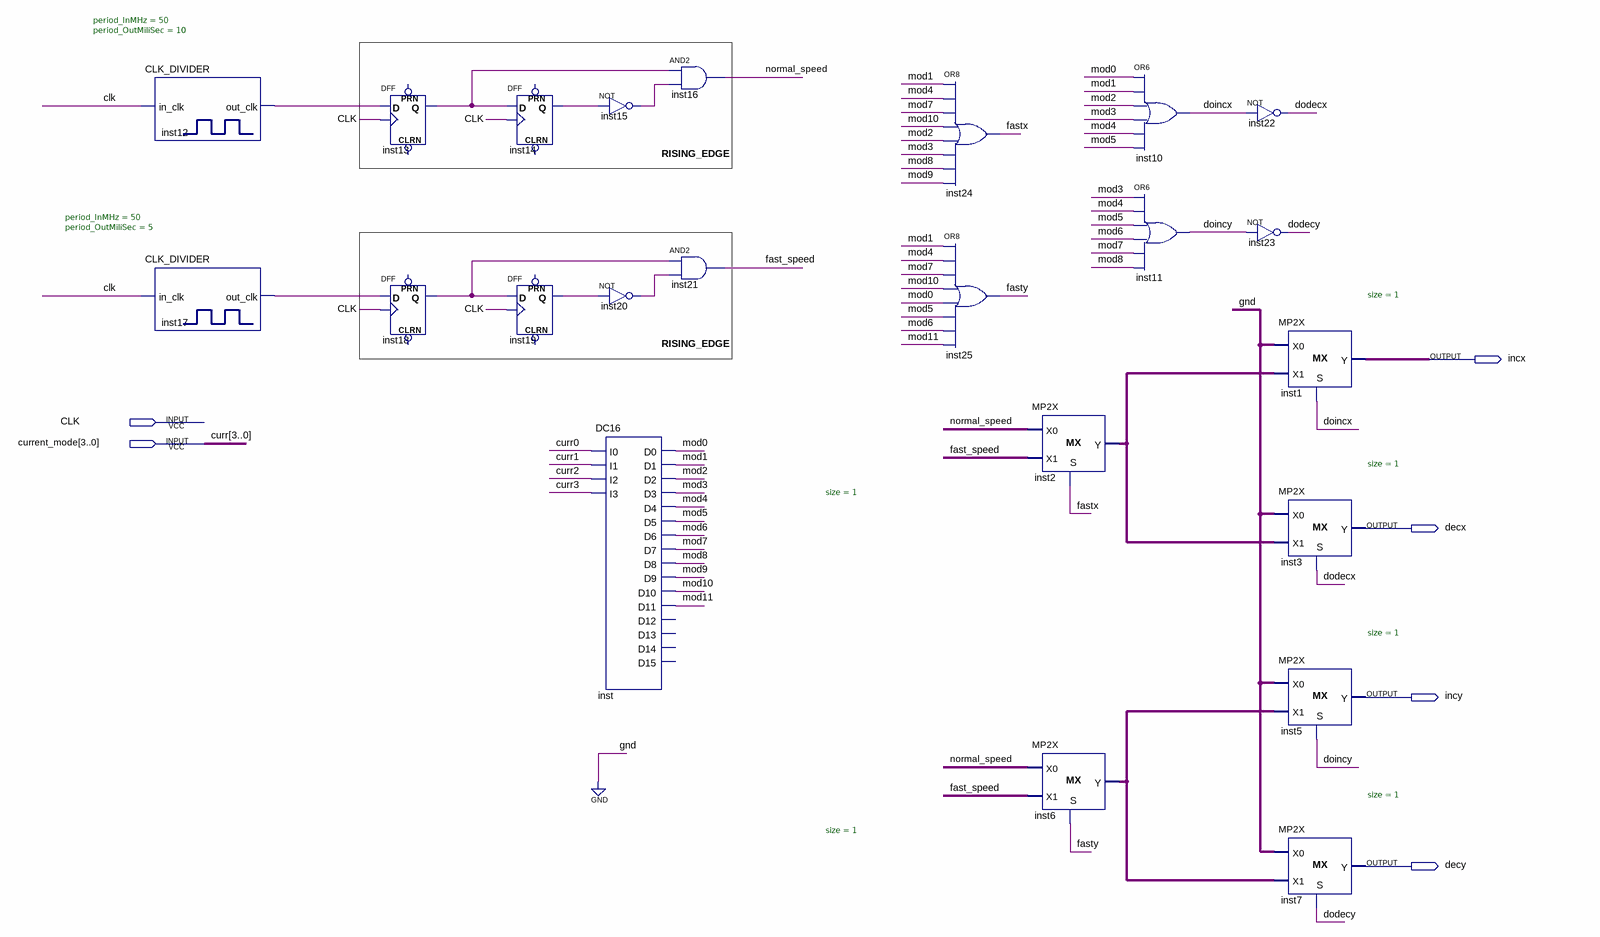
[diagram p0: schematic sheet]
// Quartus schematic ball_movement.bdf as structural Verilog: 23 symbols, 6 pins
module ball_movement (
  input  CLK,
  input  [3:0] current_mode,
  output incx,
  output decx,
  output incy,
  output decy
);

  wire dodecx, dodecy, doincx, doincy, fast_speed, fastx, fasty, inst2_y, inst6_y, inst12_out_clk, inst13_q,
       inst14_q, inst15_out, inst17_out_clk, inst18_q, inst19_q, inst20_out, mod0, mod1, mod2, mod3, mod4,
       mod5, mod6, mod7, mod8, mod9, mod10, mod11, normal_speed;

  CLK_DIVIDER #(.period_InMHz(50), .period_OutMiliSec(10)) inst12 (.in_clk(CLK), .out_clk(inst12_out_clk));
  CLK_DIVIDER #(.period_InMHz(50), .period_OutMiliSec(5)) inst17 (.in_clk(CLK), .out_clk(inst17_out_clk));
  DFF inst13 (.CLK(CLK), .D(inst12_out_clk), .Q(inst13_q));  // open: CLRN, PRN
  DFF inst18 (.CLK(CLK), .D(inst17_out_clk), .Q(inst18_q));  // open: CLRN, PRN
  DFF inst14 (.CLK(CLK), .D(inst13_q), .Q(inst14_q));  // open: CLRN, PRN
  DFF inst19 (.CLK(CLK), .D(inst18_q), .Q(inst19_q));  // open: CLRN, PRN
  not inst15 (inst15_out, inst14_q);
  not inst20 (inst20_out, inst19_q);
  DC16 inst (
    .I0(current_mode[0]), .I1(current_mode[1]), .I2(current_mode[2]), .I3(current_mode[3]), .D0(mod0),
    .D1(mod1), .D2(mod2), .D3(mod3), .D4(mod4), .D5(mod5), .D6(mod6), .D7(mod7), .D8(mod8), .D9(mod9),
    .D10(mod10), .D11(mod11));  // open: D12, D13, D14, D15
  and inst16 (normal_speed, inst13_q, inst15_out);
  and inst21 (fast_speed, inst18_q, inst20_out);
  or inst24 (fastx, mod1, mod4, mod7, mod10, mod2, mod3, mod8, mod9);
  or inst25 (fasty, mod1, mod4, mod7, mod10, mod0, mod5, mod6, mod11);
  MP2X #(.size(1)) inst2 (.S(fastx), .X0(normal_speed), .X1(fast_speed), .Y(inst2_y));
  MP2X #(.size(1)) inst6 (.S(fasty), .X0(normal_speed), .X1(fast_speed), .Y(inst6_y));
  or inst10 (doincx, mod0, mod1, mod2, mod3, mod4, mod5);
  or inst11 (doincy, mod3, mod4, mod5, mod6, mod7, mod8);
  not inst22 (dodecx, doincx);
  not inst23 (dodecy, doincy);
  MP2X #(.size(1)) inst1 (.S(doincx), .X0(1'b0), .X1(inst2_y), .Y(incx));
  MP2X #(.size(1)) inst3 (.S(dodecx), .X0(1'b0), .X1(inst2_y), .Y(decx));
  MP2X #(.size(1)) inst5 (.S(doincy), .X0(1'b0), .X1(inst6_y), .Y(incy));
  MP2X #(.size(1)) inst7 (.S(dodecy), .X0(1'b0), .X1(inst6_y), .Y(decy));

  // Other names for the same wires on the sheet: curr[3:0] = current_mode; curr0 = current_mode[0];
  //   curr1 = current_mode[1]; curr2 = current_mode[2]; curr3 = current_mode[3]

  // Notes on the sheet:
  //   RISING_EDGE
  //   RISING_EDGE
endmodule
